# Altium schematic sheet PI_CAN_Interface_v2.SchDoc: PI CAN Interface
size A4; Author: Nikola Rašević; Organization: Memristor-Robotics; Address1: Vladimira Perića Valtera; Address2: Novi Sad, 21000; Address3: Serbia; Revision: v2
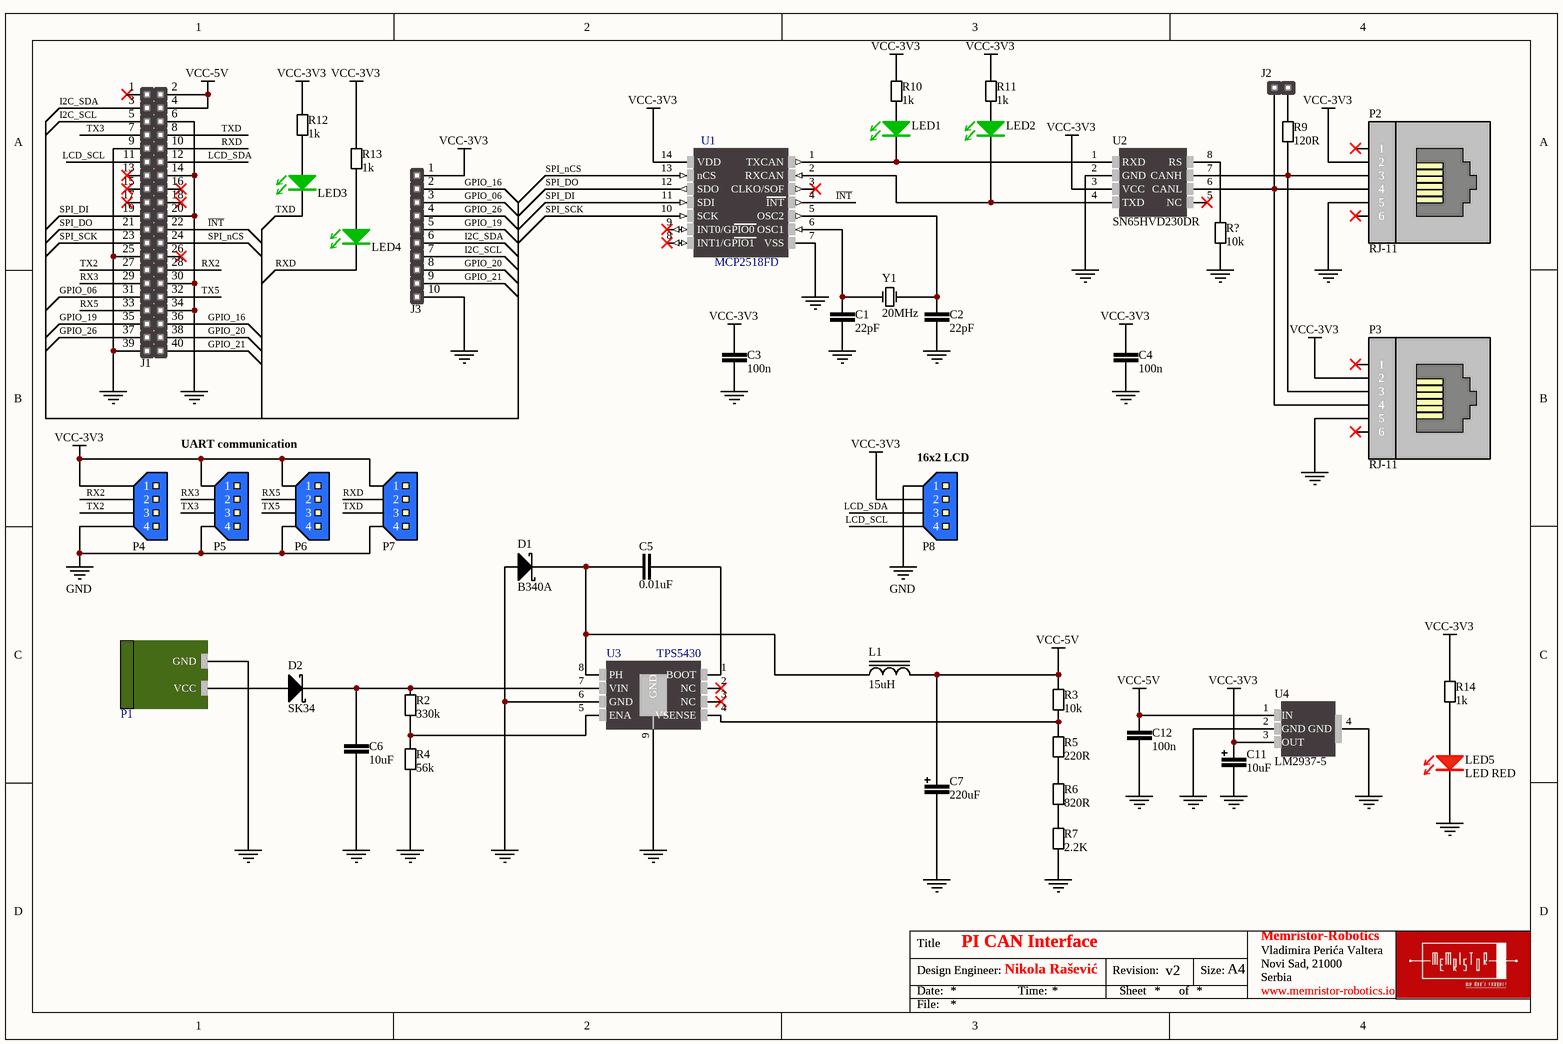
[diagram p0: PI_CAN_Interface_v2.SchDoc]

## Parts
C1  22pF  [CER_0603]
C2  22pF  [CER_0603]
C3  100n  [CER_0603]
C4  100n  [CER_0603]
C5  0.01uF  [CER_0603]
C6  10uF  [CER_1210]
C7  220uF  [TANT_1210]
C11  10uF  [TANT_1210]
C12  100n  [CER_0603]
D1  B340A  [DO214AC]
D2  SK34  [DO214AC]
J1  00000005  [HM2X20]  (value not drawn)
J2  *  [HM1x2]  (value not drawn)
J3  00000006  [HM1X10]  (value not drawn)
L1  15uH  [INDUCTOR_SS1260-103MLD]
LED1  LED GREEN  [LED_GREEN_0805]  (value not drawn)
LED2  LED GREEN  [LED_GREEN_0805]  (value not drawn)
LED3  LED GREEN  [LED_GREEN_0805]  (value not drawn)
LED4  LED GREEN  [LED_GREEN_0805]  (value not drawn)
LED5  LED RED  [LED_RED_0805]
P1  *  [PWR_Con]  (value not drawn)
P2  RJ-11  [RJ11-6N-B]
P3  RJ-11  [RJ11-6N-B]
P4  TE CONNECTIVITY_4PIN_MALE  [TE CONNECTIVITY_4PIN_MALE]  (value not drawn)
P5  TE CONNECTIVITY_4PIN_MALE  [TE CONNECTIVITY_4PIN_MALE]  (value not drawn)
P6  TE CONNECTIVITY_4PIN_MALE  [TE CONNECTIVITY_4PIN_MALE]  (value not drawn)
P7  TE CONNECTIVITY_4PIN_MALE  [TE CONNECTIVITY_4PIN_MALE]  (value not drawn)
P8  TE CONNECTIVITY_4PIN_MALE  [TE CONNECTIVITY_4PIN_MALE]  (value not drawn)
R2  330k  [RESC2013X38N-0805-NOOVERLAY]
R3  10k  [RESC2013X38N-0805-NOOVERLAY]
R4  56k  [RESC2013X38N-0805-NOOVERLAY]
R5  220R  [RESC2013X38N-0805-NOOVERLAY]
R6  820R  [RESC2013X38N-0805-NOOVERLAY]
R7  2.2K  [RESC2013X38N-0805-NOOVERLAY]
R9  120R  [RESC2013X38N-0805-NOOVERLAY]
R10  1k  [RESC2013X38N-0805-NOOVERLAY]
R11  1k  [RESC2013X38N-0805-NOOVERLAY]
R12  1k  [RESC2013X38N-0805-NOOVERLAY]
R13  1k  [RESC2013X38N-0805-NOOVERLAY]
R14  1k  [RESC2013X38N-0805-NOOVERLAY]
R?  10k  [RESC2013X38N-0805-NOOVERLAY]
U1  MCP2518FD  [SOIC14-300]
U2  SN65HVD230DR  [SOIC-8]
U3  TPS5430  [HSOP-8]
U4  LM2937-5  [SOT223]
Y1  20MHz  [OSCILATOR]

## Nets
GND: C1.1 C2.1 C3.1 C4.1 C6.1 C7.2 C11.2 C12.1 D1.2(Anode) J1.6 J1.9 J1.14 J1.20 J1.25 J1.30 J1.34 J1.39 J3.10 LED5.1(C) P1.1(GND) P2.5 P3.5 P4.4 P5.4 P6.4 P7.4 P8.1 R4.1 R7.1 R?.1 U1.7(VSS) U2.2(GND) U3.6(GND) U3.9(GND) U4.2(GND) U4.4(GND)
VCC-3V3: C3.2 C4.2 C11.1 J3.1 P2.2 P3.2 P4.1 P5.1 P6.1 P7.1 P8.2 R10.2 R11.2 R12.2 R13.2 R14.2 U1.14(VDD) U2.3(VCC) U4.3(OUT)
VCC-5V: C7.1 C12.2 J1.2 J1.4 L1.2 R3.2 U4.1(IN)
GPIO_06: J1.31 J3.3
GPIO_16: J1.36 J3.2
GPIO_19: J1.35 J3.5
GPIO_20: J1.38 J3.8
GPIO_21: J1.40 J3.9
GPIO_26: J1.37 J3.4
I2C_SCL: J1.5 J3.7
I2C_SDA: J1.3 J3.6
~{INT}: J1.22 U1.4(INT)
LCD_SCL: J1.11 P8.4
LCD_SDA: J1.12 P8.3
RX2: J1.28 P4.2
RX3: J1.29 P5.2
RX5: J1.33 P6.2
RXD: J1.10 LED4.1(C) P7.2
SPI_DI: J1.19 U1.11(SDI)
SPI_DO: J1.21 U1.12(SDO)
SPI_nCS: J1.24 U1.13(nCS)
SPI_SCK: J1.23 U1.10(SCK)
TX2: J1.27 P4.3
TX3: J1.7 P5.3
TX5: J1.32 P6.3
TXD: J1.8 LED3.1(C) P7.3
NetC1_2: C1.2 U1.6(OSC1) Y1.2(OSC2)
NetC2_2: C2.2 U1.5(OSC2) Y1.1(OSC1)
NetC5_1: C5.1 D1.1(Cathode) L1.1 U3.8(PH)
NetC5_2: C5.2 U3.1(BOOT)
NetC6_2: C6.2 D2.1(Cathode) R2.2 U3.7(VIN)
NetD2_2: D2.2(Anode) P1.2(VCC)
NetJ2_1: J2.1 P2.4 P3.4 U2.6(CANL)
NetJ2_2: J2.2 R9.2
NetLED1_1: LED1.1(C) U1.1(TXCAN) U2.1(RXD)
NetLED1_2: LED1.2(A) R10.1
NetLED2_1: LED2.1(C) U1.2(RXCAN) U2.4(TXD)
NetLED2_2: LED2.2(A) R11.1
NetLED3_2: LED3.2(A) R12.1
NetLED4_2: LED4.2(A) R13.1
NetLED5_2: LED5.2(A) R14.1
NetP2_3: P2.3 P3.3 R9.1 U2.7(CANH)
NetR2_1: R2.1 R4.2 U3.5(ENA)
NetR3_1: R3.1 R5.2 U3.4(VSENSE)
NetR5_1: R5.1 R6.2
NetR6_1: R6.1 R7.2
NetR?_2: R?.2 U2.8(RS)

Not connected (* = marked no-connect by the designer): J1 1* 13* 15* 16* 17* 18* 26*; P2 1* 6*; P3 1* 6*; U1 3(CLKO/SOF)* 8(INT1/GPIO1)* 9(INT0/GPIO0)*; U2 5(NC)*; U3 2(NC)* 3(NC)*

## Notes on the sheet
- UART communication
- (near P8) 16x2 LCD
- Title
- Date:
- Design Engineer:
- Time:
- Revision:
- Sheet
- of
- Size:
- A4
- www.memristor-robotics.io
- File:

## Library data of the parts
C1 C2 = 00002200: CAP CER 20p 0805; Capacitance: 22pF
C3-C5 C12 = 06032105: CAP CER 100n 10V X5R 10% 0603
  C3 C4 C12: Capacitance: 100n
  C5: Capacitance: 0.01uF
C6 = 00002225: CAP CER 2.2u X7R 100V 20% 1210; Capacitance: 10uF
C7 = 00011106: CAP TANT 10u 25V T491 2312; Capacitance: 220uF
C11 = 00001106: CAP TANT 10u; Value: 10uF
D1 = B360B: DIODE SCHOTTKY 60V 3A DO214AC; Manufacturer: Vishay Semiconductor Diodes Division; Barcode: 0100000007488; id: 62; Assembly: SMD; Speed: Fast Recovery =< 500ns, > 200mA (Io); Voltage  Forward: 550mV @ 3A; item_id: 1025; Recommended Rating: Silver; Manufacturer Part Number: B340A; Category: Discrete Semiconductor Products; Datasheet URL: http://www.vishay.com/docs/88896/b330la.pdf; Package Case: DO-214AC, SMA; Family: DIODE; Voltage  DC Reverse: 60V; Current  Average Rectified: 3A; Diode Type: Schottky; Part Type: Discrete Semiconductors
D2 = SK34: DIODE SCHOTTKY 40V 3A DO214AC; Manufacturer: Vishay Semiconductor Diodes Division; Barcode: 0100000007488; id: 62; Assembly: SMD; Speed: Fast Recovery =< 500ns, > 200mA (Io); Voltage  Forward: 550mV @ 3A; item_id: 1025; Recommended Rating: Silver; Manufacturer Part Number: SK34; Category: Discrete Semiconductor Products; Datasheet URL: http://www.vishay.com/docs/88896/b330la.pdf; Package Case: DO-214AC, SMA; Family: DIODE; Voltage  DC Reverse: 40V; Current  Average Rectified: 3A; Diode Type: Schottky; Part Type: Discrete Semiconductors
J2 = 00000003: Manufacturer Part Number: *
L1 = IND_10uH: FIXED IND 10uH 3A; Manufacturer: Coilcraft; Manufacturer Part Number: XAL7030-103MEB; Assembly: SMD; Tolerance: 20%; DC Resistance: 45mOhm; Category: Inductors, Coils, Chokes; Datasheet URL: http://www.mouser.com/ds/2/597/MSS7348-1076571.pdf; Package Case: 8x8mm; Inductance: 15uH; Current Rating: 3A; Family: INDUCTOR; Part Type: Inductor, Transf, Filter, Ferrite; Product Page Mouser: https://eu.mouser.com/ProductDetail/Coilcraft/MSS7348-103MEB/?qs=sGAEpiMZZMsg%252by3WlYCkU%252bbmGPYv72aIHZue6QQJkp0%3d
LED1-LED4 = LED_GREEN 0805: LED GREEN CLEAR 0805 SMD; Manufacturer: Kingbright; Manufacturer Part Number: APT2012SGC; Barcode: 2911010024338; id: 28; Voltage Forward: 2.2V; Wavelength: 568nm; Lens Color: Colorless; item_id: 3342; Recommended Rating: Platinum; Category: Optoelectronics; Assembly: SMD; Datasheet URL: http://www.kingbrightusa.com/images/catalog/SPEC/APT2012SGC.pdf; Package Case: 0805 (2012 Metric); Color: Green; Family: LED; Lens Transparency: Clear; Part Type: Optoelectronics
LED5 = LED_RED_0805: LED RED 0805; Manufacturer: BRIGHT LED ELECTRONICS; Manufacturer Part Number: BL-HUB35A-AV-TRB; Barcode: 2911010024321; id: 35; Assembly: SMD; Voltage Forward: 2.0 V; item_id: 3341; Recommended Rating: Platinum; Package Case: 0805 (2012 Metric); Color: Red; Family: LED; Part Type: Optoelectronics
P1 = 00000002: Manufacturer Part Number: *
P2 P3 = 00000001: Manufacturer Part Number: RJ-11
P4-P8 = TE CONNECTIVITY_4PIN_MALE: BLUE_4PIN_CONECTOR; Manufacturer: TE CONNECTIVITY / AMP; Manufacturer Part Number 1: 281695-3; Order Code 1: 1205983; Price 1: £0.403; Supplier 1: uk.farnell.com
R2 = 00003303: RES SMD 330 kOhm 1/8W 0805; Power: 0.125W, 1/8W; Resistance: 330k; Assembly: SMD; Barcode: 00003303
R3 = 00005102: RES SMD 51 kOhm 1/8W 0805; Power: 0.125W, 1/8W; Resistance: 10k; Assembly: SMD; Barcode: 00005102
R4 = 00005602: RES SMD 56 kOhm 1/8W 0805; Power: 0.125W, 1/8W; Barcode: 00004701; Resistance: 56k; Assembly: SMD
R5-R7 = 00009101: RES SMD 9.1 kOhm 1/8W 0805; Power: 0.125W, 1/8W; Assembly: SMD; Barcode: 00009101
  R5: Resistance: 220R
  R6: Resistance: 820R
  R7: Resistance: 2.2K
R9 = 000001200: RES SMD 120 Ohm 1/8W 0805; Resistance: 120R
R10-R14 = 00001001: RES SMD 1 kOhm 1/8W 0805; Power: 0.125W, 1/8W; Barcode: 00009101; Resistance: 1k; Assembly: SMD
R? = 000001002: RES SMD 10 kOhm 1/8W 0805; Resistance: 10k
U1 = MCP2518FD: IC CAN CONTROLLER W/SPI 18SOIC
U2 = SN65HVD230: IC EMC CAN TRANSCEIVER 8-SOIC; Assembly: SMD; Barcode: 00000001; Manufacturer Part Number: SN65HVD230DR; Comet Product Page: http://store.comet.rs/Catalogue/Product/9057/; Datasheet Link: http://www.ti.com/lit/ds/symlink/sn65hvd232.pdf; Category: Integrated Circuits (ICs); Package: SOIC-8; Family: Comunication; Supplier 1: Digi-Key; Supplier Part Number 1: 296-11654-6-ND; Supplier 2: Mouser; Supplier Part Number 2: 595-SN65HVD230DR; ComponentLink1Description: Datasheet; ComponentLink1URL: https://drive.google.com/open?id=1nnIt1YdPD-fa76215Pk9yoYp68chwc7j
U4 = 00000007: IC REG LINEAR 5V 400MA SOT223-4; Manufacturer Part Number: LM2937-5; Datasheet Link: http://www.ti.com/lit/ds/symlink/lm2937.pdf
Y1 = XtalSmd: Crystal Oscillator; Order Code: Q16.000 MHz HC-49SM SMD; Published: 8-Jun-2000; LatestRevisionDate: 17-Jul-2002; LatestRevisionNote: Re-released for DXP Platform.; PackageReference: R38; Publisher: Altium Limited; Supplier: Comet.rs; Value: 20MHz